# EAGLE schematic Adafruit Feather ESP32-C6-AUSSEN (EAGLE 9.6.2)
COMPANY: ADAFRUIT INDUSTRIES; DRAWN: KTOWN; REV: B
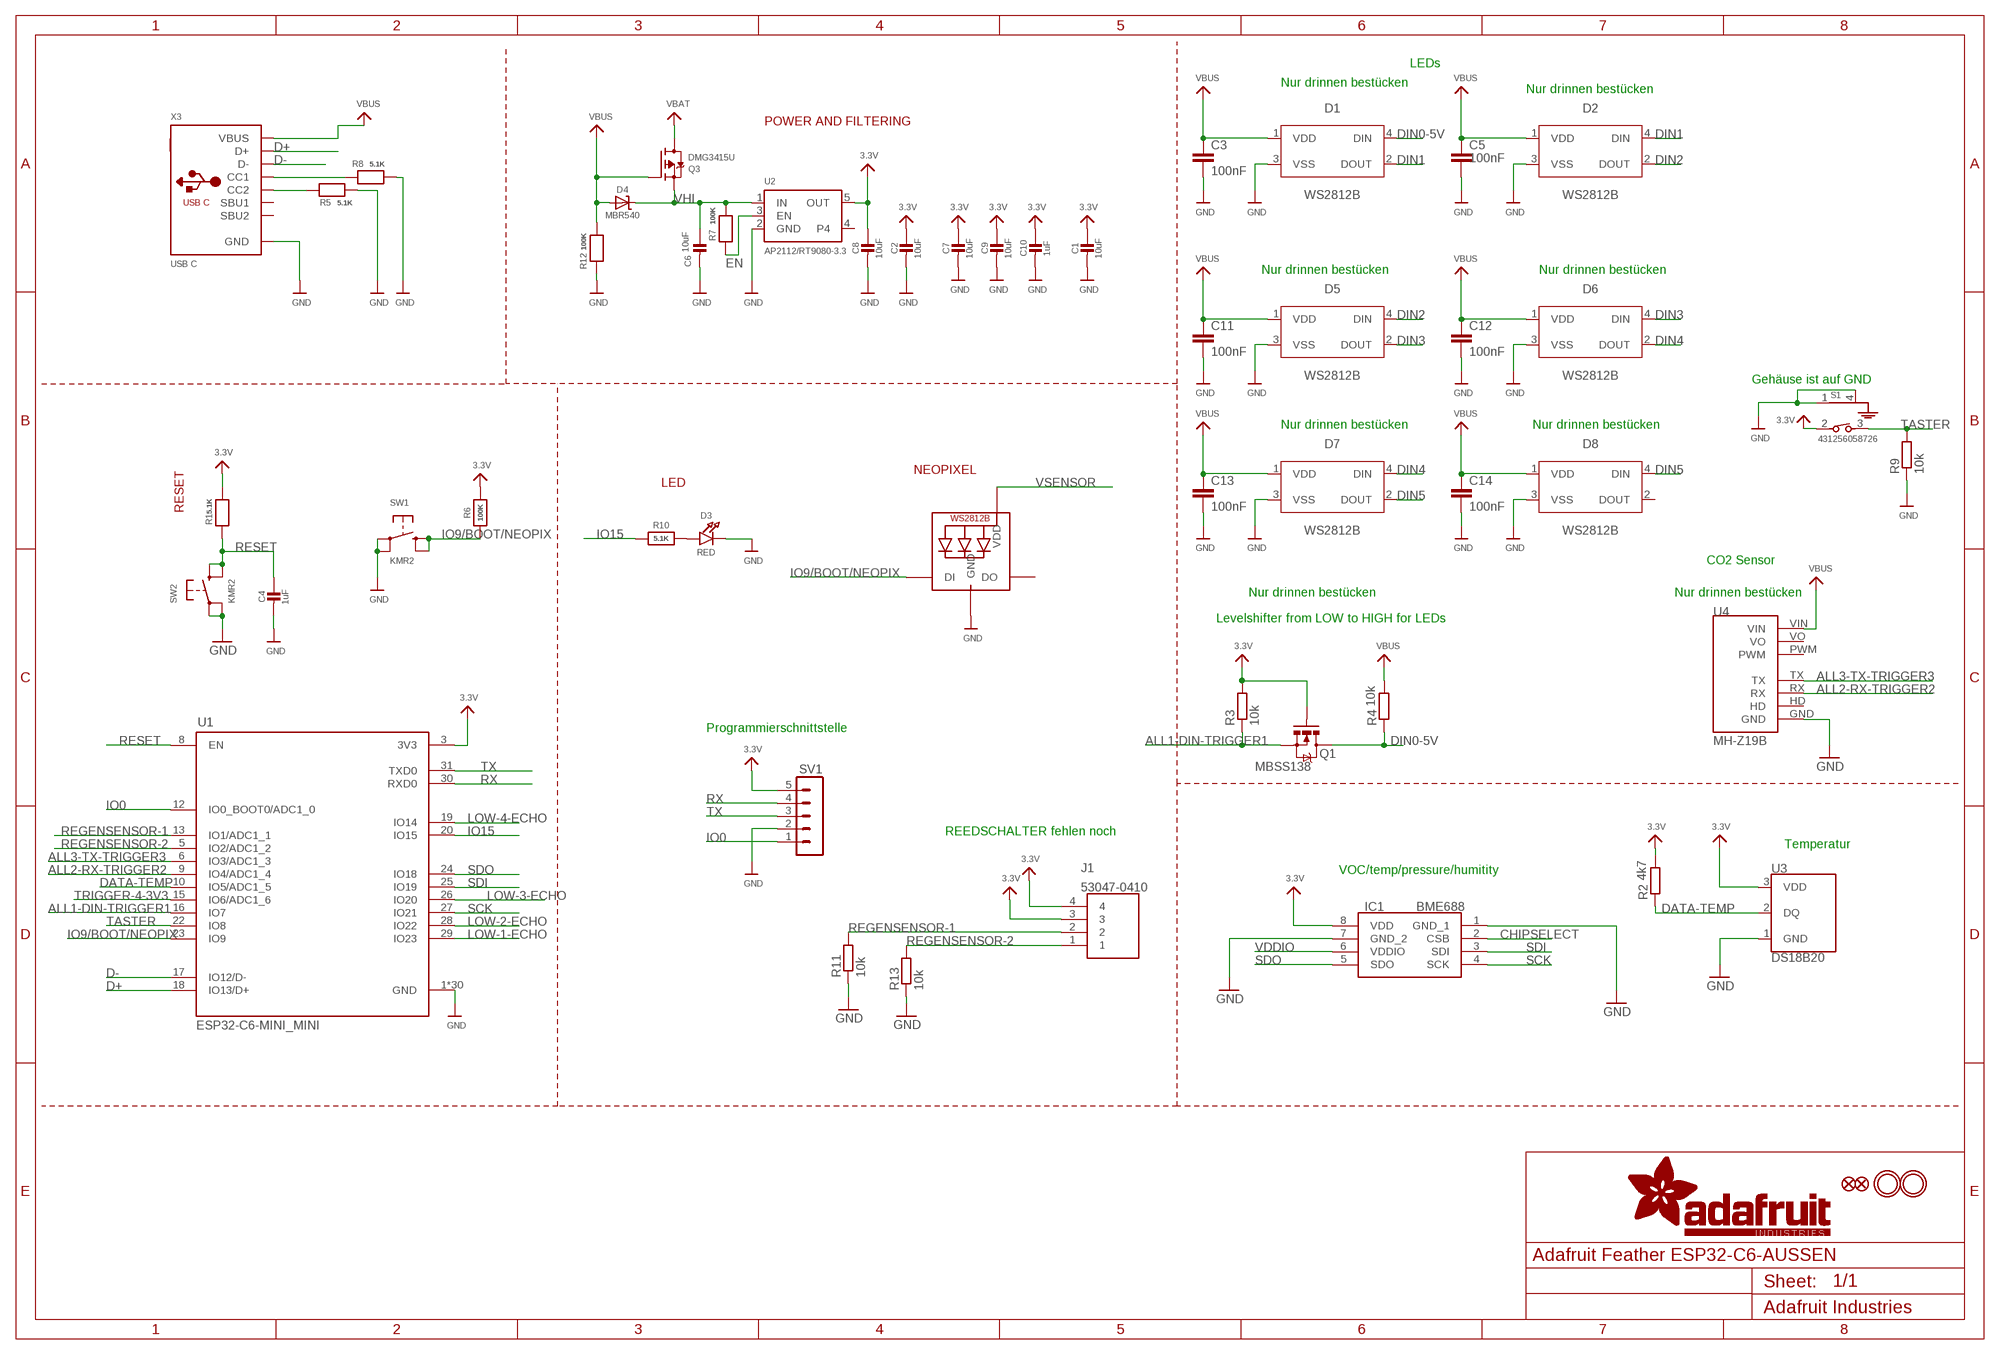
[diagram p0: schematic, sheet 1, part 1 of 2]
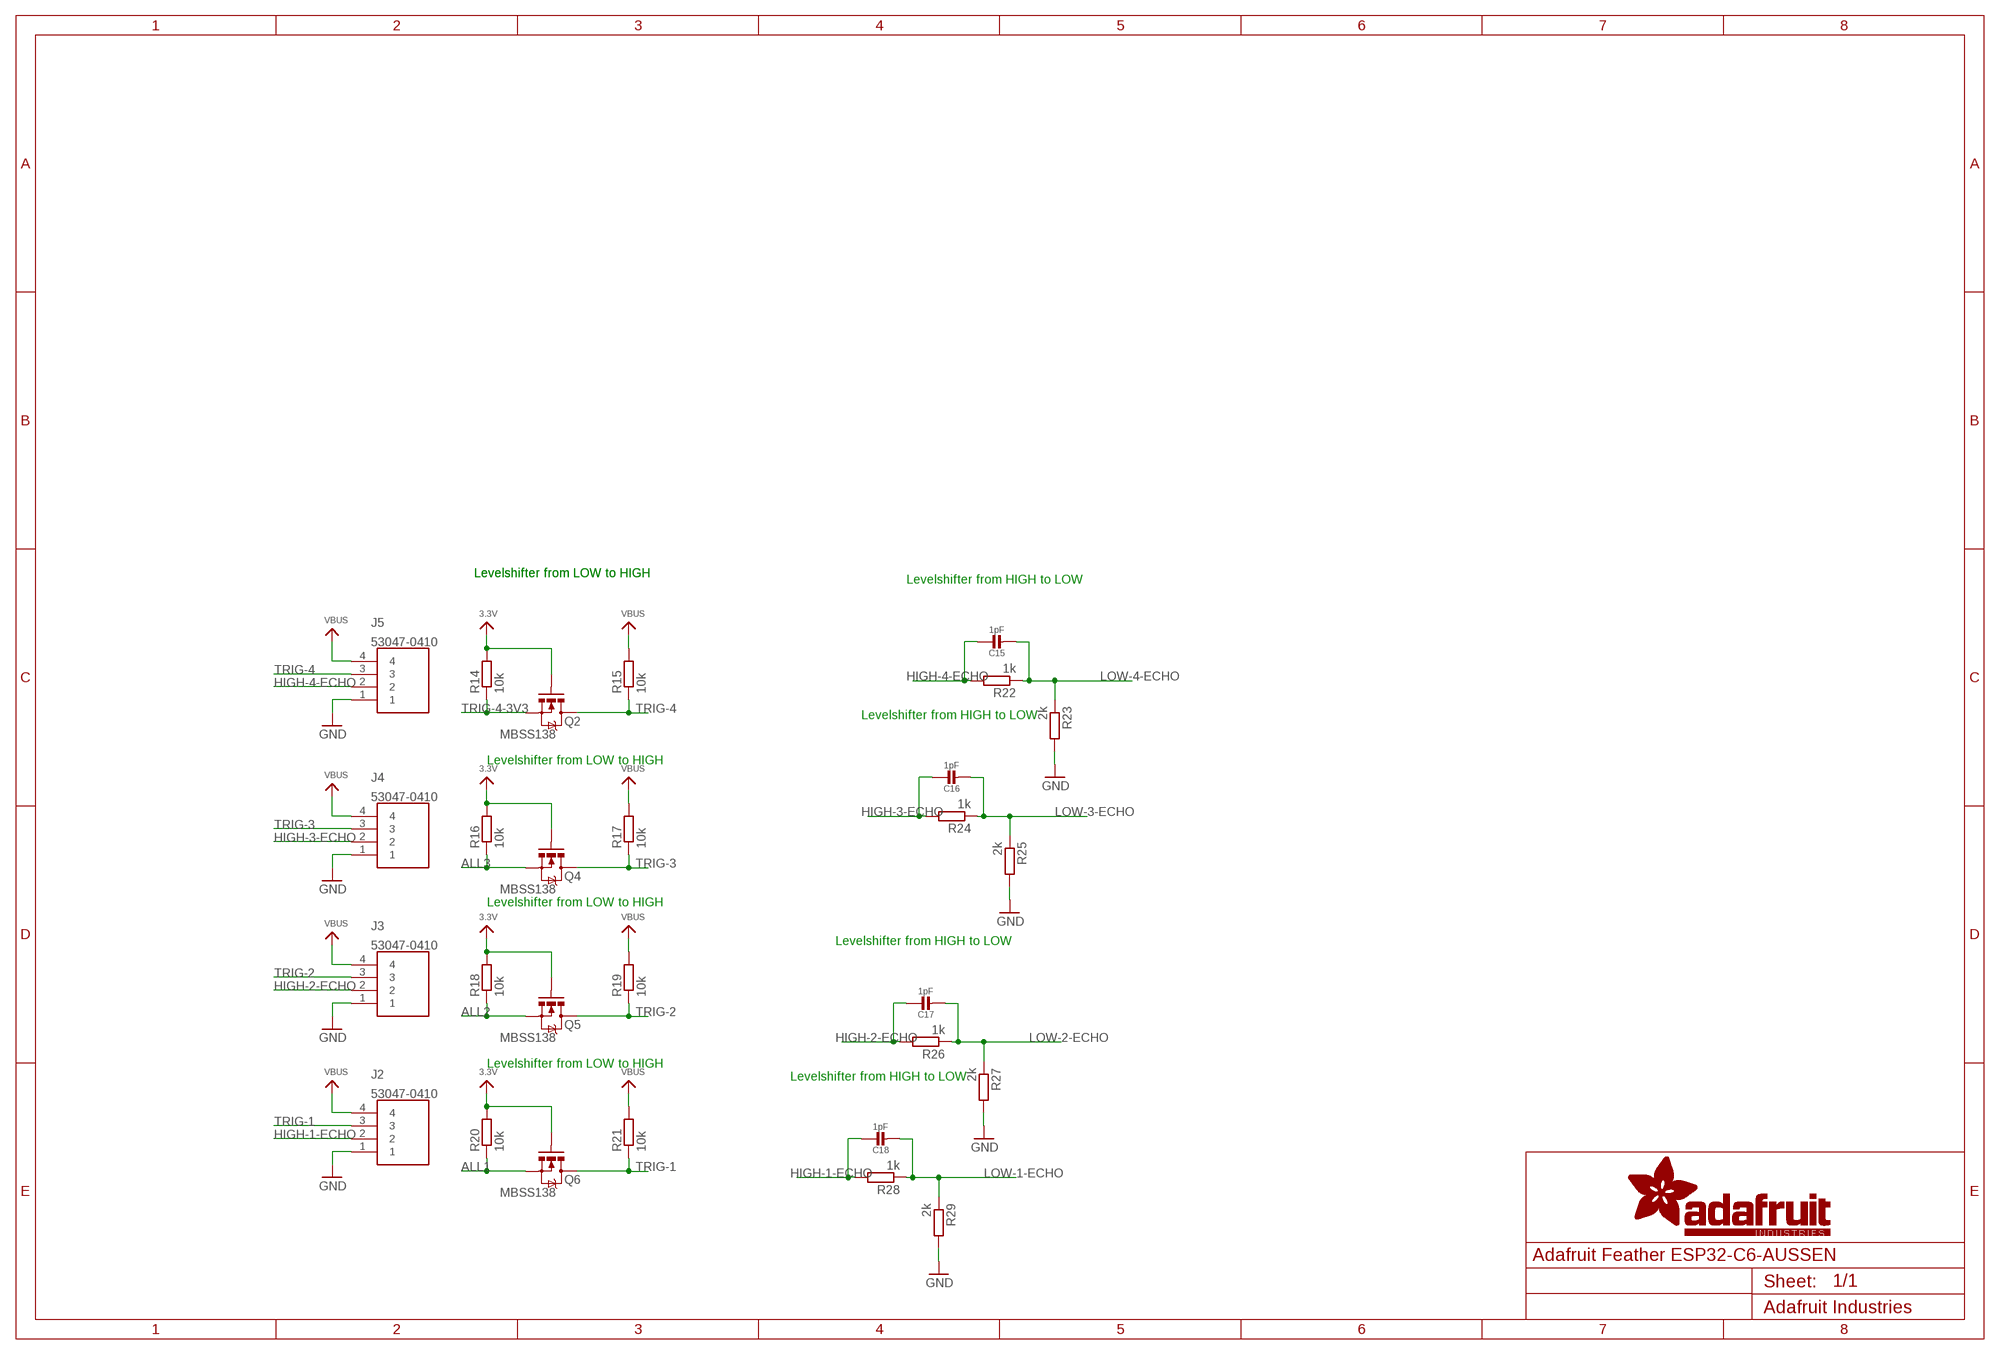
[diagram p1: schematic, sheet 1, part 2 of 2]

## Parts
C1  10uF  CAP_CERAMIC0805-NOOUTLINE  [0805-NO]
C2  10uF  CAP_CERAMIC0805-NOOUTLINE  [0805-NO]
C3  100nF  C-EUC0603  [C0603]
C4  1uF  CAP_CERAMIC0603_NO  [0603-NO]
C5  100nF  C-EUC0603  [C0603]
C6  10uF  CAP_CERAMIC0805-NOOUTLINE  [0805-NO]
C7  10uF  CAP_CERAMIC0805-NOOUTLINE  [0805-NO]
C8  10uF  CAP_CERAMIC0805-NOOUTLINE  [0805-NO]
C9  10uF  CAP_CERAMIC0805-NOOUTLINE  [0805-NO]
C10  1uF  CAP_CERAMIC0603_NO  [0603-NO]
C11  100nF  C-EUC0603  [C0603]
C12  100nF  C-EUC0603  [C0603]
C13  100nF  C-EUC0603  [C0603]
C14  100nF  C-EUC0603  [C0603]
C15  1pF  CAP_CERAMIC0603_NO  [0603-NO]
C16  1pF  CAP_CERAMIC0603_NO  [0603-NO]
C17  1pF  CAP_CERAMIC0603_NO  [0603-NO]
C18  1pF  CAP_CERAMIC0603_NO  [0603-NO]
D1  WS2812B  [WS2812B]
D2  WS2812B  [WS2812B]
D3  RED  LED0603_NOOUTLINE  [CHIPLED_0603_NOOUTLINE]
D4  MBR540  DIODE-SCHOTTKYSOD-123  [SOD-123]
D5  WS2812B  [WS2812B]
D6  WS2812B  [WS2812B]
D7  WS2812B  [WS2812B]
D8  WS2812B  [WS2812B]
IC1  BME688  [BME688]
J1  53047-0410  [530470410]
J2  53047-0410  [530470410]
J3  53047-0410  [530470410]
J4  53047-0410  [530470410]
J5  53047-0410  [530470410]
LED1  WS2812B_3535FULL  [LED3535_FULLPADS]
Q1  MBSS138  MOSFET-NCHANNELBSS138  [SOT23]
Q2  MBSS138  MOSFET-NCHANNELBSS138  [SOT23]
Q3  DMG3415U  MOSFET-P  [SOT23-R]
Q4  MBSS138  MOSFET-NCHANNELBSS138  [SOT23]
Q5  MBSS138  MOSFET-NCHANNELBSS138  [SOT23]
Q6  MBSS138  MOSFET-NCHANNELBSS138  [SOT23]
R1  5.1K  RESISTOR_0603_NOOUT  [0603-NO]
R2  4k7  R-EU_0207/12  [0207/12]
R3  10k  R-EU_0207/12  [0207/12]
R4  10k  R-EU_0207/12  [0207/12]
R5  5.1K  RESISTOR_0603_NOOUT  [0603-NO]
R6  100K  RESISTOR_0603_NOOUT  [0603-NO]
R7  100K  RESISTOR_0603_NOOUT  [0603-NO]
R8  5.1K  RESISTOR_0603_NOOUT  [0603-NO]
R9  10k  R-EU_0207/12  [0207/12]
R10  5.1K  RESISTOR_0603_NOOUT  [0603-NO]
R11  10k  R-EU_0207/12  [0207/12]
R12  100K  RESISTOR_0603_NOOUT  [0603-NO]
R13  10k  R-EU_0207/12  [0207/12]
R14  10k  R-EU_0207/12  [0207/12]
R15  10k  R-EU_0207/12  [0207/12]
R16  10k  R-EU_0207/12  [0207/12]
R17  10k  R-EU_0207/12  [0207/12]
R18  10k  R-EU_0207/12  [0207/12]
R19  10k  R-EU_0207/12  [0207/12]
R20  10k  R-EU_0207/12  [0207/12]
R21  10k  R-EU_0207/12  [0207/12]
R22  1k  R-EU_0207/12  [0207/12]
R23  2k  R-EU_0207/12  [0207/12]
R24  1k  R-EU_0207/12  [0207/12]
R25  2k  R-EU_0207/12  [0207/12]
R26  1k  R-EU_0207/12  [0207/12]
R27  2k  R-EU_0207/12  [0207/12]
R28  1k  R-EU_0207/12  [0207/12]
R29  2k  R-EU_0207/12  [0207/12]
S1  431256058726  [4312560587X6]
SV1  MAR05-1  [MAR05-1]
SW1  KMR2  SWITCH_TACT_SMT_RKB2  [BTN_RKB2_4.6X2.8]
SW2  KMR2  SWITCH_TACT_SMT_RKB2  [BTN_RKB2_4.6X2.8]
U1  ESP32-C6-MINI_MINI  [ESP32-PICO-MINI]
U2  AP2112/RT9080-3.3  VREG_SOT23-5  [SOT23-5]
U3  DS18B20  [TO-92-AMMO]
U4  MH-Z19B  [MH-Z19B]
U$31  MOUNTINGHOLE2.5  [MOUNTINGHOLE_2.5_PLATED]
U$32  MOUNTINGHOLE2.5  [MOUNTINGHOLE_2.5_PLATED]
U$34  FIDUCIAL_1MM  [FIDUCIAL_1MM]
U$35  FIDUCIAL_1MM  [FIDUCIAL_1MM]
X3  USB C  USB_C  [USB_C_CUSB31-CFM2AX-01-X]

## Nets
3.3V: C1.1 C2.1 C7.1 C8.1 C9.1 C10.1 IC1.8(VDD) J1.3 J1.4 Q1.1(G) Q2.1(G) Q4.1(G) Q5.1(G) Q6.1(G) R1.2 R2.2 R3.2 R6.2 R14.2 R16.2 R18.2 R20.2 S1.2 SV1.5 U1.3(3V3) U2.5(OUT) U3.3(VDD)
ALL1: Q6.2(S) R20.1
ALL1-DIN-TRIGGER1: Q1.2(S) R3.1 U1.16(IO7)
ALL2: Q5.2(S) R18.1
ALL2-RX-TRIGGER2: U1.9(IO4/ADC1_4) U4.RX
ALL3: Q4.2(S) R16.1
ALL3-TX-TRIGGER3: U1.6(IO3/ADC1_3) U4.TX
CHIPSELECT: IC1.2(CSB)
D+: U1.18(IO13/D+) X3.A6(D+) X3.B6(D+)
D-: U1.17(IO12/D-) X3.A7(D-) X3.B7(D-)
DATA-TEMP: R2.1 U1.10(IO5/ADC1_5) U3.2(DQ)
DIN0-5V: D1.4(DIN) Q1.3(D) R4.1
DIN1: D1.2(DOUT) D2.4(DIN)
DIN2: D2.2(DOUT) D5.4(DIN)
DIN3: D5.2(DOUT) D6.4(DIN)
DIN4: D6.2(DOUT) D7.4(DIN)
DIN5: D7.2(DOUT) D8.4(DIN)
EN: R7.1 U2.3(EN)
GND: C1.2 C2.2 C3.2 C4.2 C5.2 C6.2 C7.2 C8.2 C9.2 C10.2 C11.2 C12.2 C13.2 C14.2 D1.3(VSS) D2.3(VSS) D3.C D5.3(VSS) D6.3(VSS) D7.3(VSS) D8.3(VSS) IC1.1(GND_1) IC1.7(GND_2) J2.1 J3.1 J4.1 J5.1 LED1.4(GND) R5.1 R8.1 R9.1 R11.1 R12.1 R13.1 R23.2 R25.2 R27.2 R29.2 S1.1(GND1) S1.4(GND) SV1.2 SW1.A'(P1) SW1.A(P) SW2.A'(P1) SW2.A(P) U1.1(GND) U1.2(GND) U1.11(GND) U1.14(GND) U1.36(GND) U1.37(GND) U1.38(GND) U1.39(GND) U1.40(GND) U1.41(GND) U1.42(GND) U1.43(GND) U1.44(GND) U1.45(GND) U1.46(GND) U1.47(GND) U1.48(GND) U1.49(GND) U1.50(GND) U1.51(GND) U1.52(GND) U1.53(GND) U1.54(GND) U1.55(GND) U1.56(GND) U1.57(GND) U1.58(GND) U1.59(GND) U1.60(GND) U1.61(GND) U2.2(GND) U3.1(GND) U4.GND X3.A1B12(GND) X3.B1A12(GND)
HIGH-1-ECHO [Power]: C18.1 J2.2 R28.2
HIGH-2-ECHO [Power]: C17.1 J3.2 R26.2
HIGH-3-ECHO [Power]: C16.1 J4.2 R24.2
HIGH-4-ECHO [Power]: C15.1 J5.2 R22.2
IO0: SV1.1 U1.12(IO0_BOOT0/ADC1_0)
IO9/BOOT/NEOPIX: LED1.1(DI) R6.1 SW1.B'(S1) SW1.B(S) U1.23(IO9)
IO15: R10.1 U1.20(IO15)
LOW-1-ECHO: C18.2 R28.1 R29.1 U1.29(IO23)
LOW-2-ECHO: C17.2 R26.1 R27.1 U1.28(IO22)
LOW-3-ECHO: C16.2 R24.1 R25.1 U1.26(IO20)
LOW-4-ECHO: C15.2 R22.1 R23.1 U1.19(IO14)
N$5: D3.A R10.2
N$8: R8.2 X3.A5(CC1)
N$9: R5.2 X3.B5(CC2)
REGENSENSOR-1: J1.2 R11.2 U1.13(IO1/ADC1_1)
REGENSENSOR-2: J1.1 R13.2 U1.5(IO2/ADC1_2)
RESET: C4.1 R1.1 SW2.B'(S1) SW2.B(S) U1.8(EN)
RX: SV1.4 U1.30(RXD0)
SCK: IC1.4(SCK) U1.27(IO21)
SDI: IC1.3(SDI) U1.25(IO19)
SDO: IC1.5(SDO) U1.24(IO18)
TASTER: R9.2 S1.3 U1.22(IO8)
TRIG-1: J2.3 Q6.3(D) R21.1
TRIG-2: J3.3 Q5.3(D) R19.1
TRIG-3: J4.3 Q4.3(D) R17.1
TRIG-4: J5.3 Q2.3(D) R15.1
TRIG-4-3V3: Q2.2(S) R14.1
TRIGGER-4-3V3: U1.15(IO6/ADC1_6)
TX: SV1.3 U1.31(TXD0)
VBAT [Power]: Q3.3(D)
VBUS [Power]: C3.1 C5.1 C11.1 C12.1 C13.1 C14.1 D1.1(VDD) D2.1(VDD) D4.A D5.1(VDD) D6.1(VDD) D7.1(VDD) D8.1(VDD) J2.4 J3.4 J4.4 J5.4 Q3.1(G) R4.2 R12.2 R15.2 R17.2 R19.2 R21.2 U4.VIN X3.A4B9(VBUS) X3.B4A9(VBUS)
VDDIO: IC1.6(VDDIO)
VHI [Power]: C6.1 D4.C Q3.2(S) R7.2 U2.1(IN)
VSENSOR [Power]: LED1.2(VDD)
Unconnected: D8.2(DOUT) LED1.3(DO) U2.4 U4.HD U4.PWM U4.VO X3.A8(SBU1) X3.B8(SBU2)

## Notes on the sheet
- LEDs
- Nur drinnen bestücken
- Nur drinnen bestücken
- POWER AND FILTERING
- Nur drinnen bestücken | Nur drinnen bestücken
- Gehäuse ist auf GND
- Nur drinnen bestücken | Nur drinnen bestücken
- NEOPIXEL
- LED
- RESET
- CO2 Sensor
- Levelshifter from LOW to HIGH | Levelshifter from LOW to HIGH
- Levelshifter from HIGH to LOW
- Nur drinnen bestücken | Nur drinnen bestücken
- Levelshifter from LOW to HIGH for LEDs
- Levelshifter from HIGH to LOW
- Programmierschnittstelle
- Levelshifter from LOW to HIGH
- REEDSCHALTER fehlen noch
- Temperatur
- VOC/temp/pressure/humitity
- Levelshifter from LOW to HIGH
- Levelshifter from HIGH to LOW
- Levelshifter from LOW to HIGH
- Levelshifter from HIGH to LOW

## Library data of the parts
C1 C2 C4 C6 C7 C9 C10 C15-C18 = microbuilder:CAP_CERAMIC: Ceramic Capacitors For new designs, use the packages preceded by an '_' character since they are more reliable: The following footprints should be used on most boards: _0402 - Standard footprint for regular board layouts _0603 - Standard footprint for regular board layouts _0805 - Standard footprint for regular board layouts _1206 - Standard footprint for regular board layouts For extremely tight-pitch boards where space is at a premium, the following 'micro-pitch' footprints can be used (smaller pads, no silkscreen outline, etc.): _0402MP - Micro-pitch footprint for very dense/compact boards _0603MP - Micro-pitch footprint for very dense/compact boards _0805MP - Micro-pitch footprint for very dense/compact boards _1206MP - Micro-pitch footprint for very dense/compact boards
C3 C5 C11-C14 = rcl:C-EU: CAPACITOR, European symbol; SPICEPREFIX: C
C8 = microbuilder:CAP_CERAMIC: Ceramic Capacitors For new designs, use the packages preceded by an '_' character since they are more reliable: The following footprints should be used on most boards: _0402 - Standard footprint for regular board layouts _0603 - Standard footprint for regular board layouts _0805 - Standard footprint for regular board layouts _1206 - Standard footprint for regular board layouts For extremely tight-pitch boards where space is at a premium, the following 'micro-pitch' footprints can be used (smaller pads, no silkscreen outline, etc.): _0402MP - Micro-pitch footprint for very dense/compact boards _0603MP - Micro-pitch footprint for very dense/compact boards _0805MP - Micro-pitch footprint for very dense/compact boards _1206MP - Micro-pitch footprint for very dense/compact boards; REV: B
D1 D2 D5-D8 = LED:WS2812B: Intelligent control LED integrated light source Datasheet <https://cdn-shop.adafruit.com/datasheets/WS2812B.pdf>; CATEGORY: LED; COLOR: RGB; DATASHEET: https://cdn-shop.adafruit.com/datasheets/WS2812B.pdf; DESCRIPTION: LED integrated light source; MANUFACTURER: Worldsemi; MPN: WS2812B; OPERATING_TEMPERATURE: -55°C ~ 150°C; PACKAGE_SIZE: 5050; PACKAGE_TYPE: SMD; PART_STATUS: ACTIVE; ROHS: COMPLIANT; SERIES: WS2812B; SUBCATEGORY: Chip LED Addressable; TYPE: Square with Flat Top
D3 = microbuilder:LED: LED 0603 - 0603 Surface Mount Package 2mA: Green LED - Low Power (3.9mcd, 2ma, 1.7Vf) - Digikey: 475-2709-2-ND Orange LED - Low Power (9.8mcd, 2ma, 1.8Vf) - Digikey: 475-1194-2-ND Red LED - Low Power (5mcd, 2ma, 1.8Vf) - Digikey: 475-1195-2-ND Yellow LED - Low Power (7mcd, 2ma, 1.8Vf) - Digikey: 475-1196-2-ND 5mA: Blue LED - Low Power (17mcd, 5ma, 2.9Vf) - Digikey: LNJ937W8CRACT-ND 0805 - 0805 Surface Mount Package 2mA: Red LED (8.8mcd, 2mA, 1.8Vf, Clear) - Low Power [Digikey: 475-2510-1-ND] Green LED (5mcd, 2mA, 1.8Vf, Clear) - Low Power [Digikey: 475-2730-1-ND] Yellow LED (11.3mcd, 2mA, 1.8Vf, Clear) - Low Power [Digikey: 475-2555-1-ND] 20mA: Red LED (104mcd, 20mA, Diffused) - LS R976 [Digikey: 475-1278-6-ND] Red LED (12mcd, 20mA, 2.0Vf, Clear) - APT2012EC [Digikey: 754-1128-1-ND] Green LED (15mcd, 20mA, 2.2Vf, Clear) - APT2012GC [Digikey: 754-1131-1-ND] Orange LED (160mcd, 20mA, 2.1Vf, Clear) - APT2012SECK [Digikey: 754-1130-1-ND] 1206 - 1206 Surface Mount Package Green LED (26mcd, 20mA, Diffused) - LG N971 [Digikey: 475-1407-6-ND] Red LED (15mcd, 20mA, Diffused) - LH N974 [Digikey: 475-1416-6-ND] Cree - Cree High-Power Surface Mount LEDs XPEBWT-L1-0000-00D50 - White 111lm 350mA 2.9Vf 6200K 110° XTEAWT-00-0000-00000LEE3 - White 114lm 350mA 2.85Vf 5000K 115° Everlight - Everlight 45-21 Series Surface Mount LEDs 45-21/QK2C-B2832AC2CB2/2T - Warm White 2000mcd 20mA 3.25Vf 3050K 120° 45-21/LK2C-B38452C4CB2/2T - Nuetral White 2000mcd 20mA 3.25Vf 4150K 120° 45-21/LK2C-B50634C6CB2/2T - Cold White 2200mcd 20mA 3.25Vf 5650K 120° PLCC2 Reverse Mount LS T77K-J1L2-1-0-2-R18-Z - Red 11.25mcd 2mA 1.8Vf 630nm 120° LO T77K-L1M2-24-Z - Orange 19.6mcd 2mA 1.8Vf 606nm 120° LY T77K-K2M1-26-Z - Yellow 15.7mcd 2mA 1.8Vf 587nm 120°; ROT: 270
D4 = microbuilder:DIODE-SCHOTTKY
IC1 = BME688:BME688: Gas sensor measuring relative humidity, barometric pressure, ambient temperature and gas (VOC) Source: Datasheet <https://www.bosch-sensortec.com/media/boschsensortec/downloads/datasheets/bst-bme688-ds000.pdf>; DESCRIPTION: Gas sensor measuring relative humidity, barometric pressure, ambient temperature and gas (VOC); HEIGHT: 1mm; MANUFACTURER_NAME: BOSCH; MANUFACTURER_PART_NUMBER: BME688; MOUSER_PART_NUMBER: 262-BME688; MOUSER_PRICE-STOCK: https://www.mouser.co.uk/ProductDetail/Bosch-Sensortec/BME688?qs=IS%252B4QmGtzzqQoVDscqwx3A%3D%3D
J1-J5 = 53047-0410:53047-0410: Headers & Wire Housings VERTICAL HDR 4P Source: Datasheet <https://www.molex.com/pdm_docs/sd/530470410_sd.pdf>; DESCRIPTION: Headers & Wire Housings VERTICAL HDR 4P; HEIGHT: 4.4mm; MANUFACTURER_NAME: Molex; MANUFACTURER_PART_NUMBER: 53047-0410; MOUSER_PART_NUMBER: 538-53047-0410; MOUSER_PRICE-STOCK: https://www.mouser.co.uk/ProductDetail/Molex/53047-0410?qs=DcEdecHHM4i8IPBxVAuJtg%3D%3D
LED1 = microbuilder:WS2812B
Q1 Q2 Q4-Q6 = BeagleBone_Blue_R3:MOSFET-NCHANNEL: Common NMOSFET Parts MFG P/N Store ID Prod ID FDD8780 TRANS-09984 SI7820DN TRANS-11055 FDS6630A IC-08089 2N7002PW TRANS-11151 FQP30N06L COM-10213 TRANS-10060 BSS123LT1G TRANS-08345 BSS138 TRANS-00830 BS170 2N7000; PROD_ID: TRANS-00830
Q3 = microbuilder:MOSFET-P: P-Channel Mosfet LEGEND VDS: Voltage Drain-Source ID: Drain Current RDS(ON): Drain-Source On-State Resistance VGS(TH): Gate-Source Threshold Voltage CISS: Drain-Source Input Capacitance SOT-23 Name VDS ID RDS(ON) VGS(TH) CISS Order Number IRLML5103 30V 760mA 600 mOhm -- 75pF @ 25V Digikey: IRLML5103PBFCT-ND IRLML6401 12V 4.3A 50 mOhm 950mV @ 250µA 830pF @ 10V Digikey: IRLML6401PBFTR-ND NTR0202PL 20V 400mA 800 mOhm 2.3V @ 250uA 70pF @ 5V Digikey: NTR0202PLT1GOSTR-ND NTR4101PT1G 20V 1.8A 85 mOhm 1.2V @ 250uA 675pF @ 10V Digikey: NTR4101PT1GOSCT-ND DMP2004K 20V 600mA 900 mOhm 1V @ 250uA 175pF @ 16V Digikey: DMP2004KDICT-ND PMV65XP 20V 3.9A 76 mOhm 950mV @ 1mA 725pF @ 20V Digikey: 568-2358-2-ND TO-252 Name VDS ID RDS(ON) VGS(TH) CISS Order Number AOD417 30V 25A 34 mOhm 3V @ 250µA 920pF @ 15V Digikey: 785-1106-2-ND PowerPak Name VDS ID RDS(ON) VGS(TH) CISS Order Number AON7401 30V 12A 14 mOhm 3V @ 250µA 2600pF @ 15V Digikey: 785-1302-1-ND
R1 R5-R8 R10 R12 = microbuilder:RESISTOR: Resistors For new designs, use the packages preceded by an '_' character since they are more reliable: The following footprints should be used on most boards: _0402 - Standard footprint for regular board layouts _0603 - Standard footprint for regular board layouts _0805 - Standard footprint for regular board layouts _1206 - Standard footprint for regular board layouts For extremely tight-pitch boards where space is at a premium, the following 'micro-pitch' footprints can be used (smaller pads, no silkscreen outline, etc.): _0402MP - Micro-pitch footprint for very dense/compact boards _0603MP - Micro-pitch footprint for very dense/compact boards _0805MP - Micro-pitch footprint for very dense/compact boards _1206MP - Micro-pitch footprint for very dense/compact boards
R2-R4 R9 R11 R13-R29 = rcl:R-EU_: RESISTOR, European symbol
S1 = 431256058726:431256058726: Check availability <https://pricing.snapeda.com/parts/431256058716/W%C3%BCrth%20Elektronik/view-part?ref=eda>; AVAILABILITY: In Stock; CHECK_PRICES: https://www.snapeda.com/parts/431256058716/W%25C3%25BCrth+Elektronik+Midcom/view-part/?ref=eda; DESCRIPTION: Tactile Switch SPST-NO Side Actuated Through Hole, Right Angle; MF: Würth Elektronik; MP: 431256058716; PACKAGE: None; PRICE: None; SNAPEDA_LINK: https://www.snapeda.com/parts/431256058716/W%25C3%25BCrth+Elektronik+Midcom/view-part/?ref=snap
SV1 = con-lstb:MAR05-1: PIN HEADER; OC_FARNELL: unknown; OC_NEWARK: unknown
SW1 SW2 = adafruit_electromech:SWITCH_TACT_SMT: SMT Tact Switches RKB2 https://www.digikey.com/short/m027prz5
U1 = adafruit_wireless:ESP32-C6-MINI
U2 = adafruit_power:VREG_SOT23-5: SOT23-5 Fixed Voltage Regulators Part Current Out V Out V In V Dropout θJA (°C/W) TJ (°C) Digikey Part No. ADP121 150mA 3.3V 3.4-5.5V 0.09V @ 150mA -- -- ADP121-AUJZ33R7CT-ND ADP121 150mA 3.0V 3.1-5.5V 0.09V @ 150mA -- -- ADP121-AUJZ30R7CT-ND ADP122 300mA 3.3V 3.4-5.5V 0.085V @ 300mA -- -- ADP122AUJZ-3.3-R7CT-ND ADP1712 300mA 3.3V 3.5-5.5V 0.17V @ 300mA -- -- ADP1712AUJZ-3.3-R7TR-ND AP7311 (Low Cost) 150mA 3.3V 3.5-6V 0.15V @ 150mA -- -- AP7311-33WG-7DICT-ND LD39015M18R 150mA 1.8V 1.9V-5.5V 0.08V @ 100mA -- -- 497-6977-1-ND LP2985A-33DBVR 150mA 3.3V 3.3-16V 0.28V @ 150mA 206 150 296-18479-1-ND MCP1824T-3302E/OT 300mA 3.3V 3.5V-6V 0.2V @ 300mA -- -- MCP1824T-3302E/OTCT-ND MIC5205-2.5YM5 TR 150mA 2.5V 2.7-16V 0.165V @ 150mA -- -- 576-1257-2-ND MIC5205-3.0YM5 TR 150mA 3.0V 3.2V-16V 0.165V @ 150mA -- -- 576-1258-2-ND MIC5205-3.3YM5 TR 150mA 3.3V 3.5V-16V 0.165V @ 150mA -- -- 576-1259-2-ND TPS780330220 150mA 3.3V+2.2V 3.6-5.5V 250mV Max -- -- 296-23332-1-ND TDA3663/N1,135 100mA 3.3V 3.5-45V 0.18V @ 50mA -- -- 568-5343-1-ND Max operating temp can be calculated using θJA, TJ (max junction temperature), and power in watts. Set the "Maximum Ambient Temperature" until it reaches TJ ("Max Junction Temperature"), which is the absolute limit for safe use of the regulator: Heat Sink Temperature Calculator <http://www.daycounter.com/Calculators/Heat-Sink-Temperature-Calculator.phtml> For example, With 12V source into a 3.3V LP2985 and a 30mA load, we are dissipating (12V-3.3V) * 0.03A = 0.261W. With a θJA of 206 °C/W, a TJ of 150°C, and 261mW we can safely use the chip without a heat sink up to 75°C (=147.1°C Junction Temperature).; JLC_ROTATION: 0
U3 = SparkFun-Sensors:DS18B20: Dallas/Maxim DS18B20 1-Wire Temperature Sensor The DS18B20 reports degrees C with 9 to 12-bit precision, -55C to 125C (+/-0.5C). Each sensor has a unique 64-Bit Serial number etched into it - allows for a huge number of sensors to be used on one data bus. Datasheet <http://datasheets.maximintegrated.com/en/ds/DS18B20.pdf> SparkFun Products One Wire Digital Temperature Sensor - DS18B20 <https://www.sparkfun.com/products/245> (SEN-00245); STORE_ID: SEN-00245
U4 = MH-Z19B:MH-Z19B: Check availability <https://pricing.snapeda.com/parts/MH-Z19B/Winsen/view-part?ref=eda>; AVAILABILITY: Not in stock; CHECK_PRICES: https://www.snapeda.com/parts/MH-Z19B/Winsen/view-part/?ref=eda; DESCRIPTION: Intelligent Infrared CO2 Module; MF: Winsen; MP: MH-Z19B; PACKAGE: Package; PRICE: None; SNAPEDA_LINK: https://www.snapeda.com/parts/MH-Z19B/Winsen/view-part/?ref=snap
U$31 U$32 = adafruit_electromech:MOUNTINGHOLE: Mounting Hole For #2 screws (0.086"/2.18mm width, 0.094"/2.4mm hole) use 2.5mm; BOM: EXCLUDE
U$34 U$35 = microbuilder:FIDUCIAL: Fiducial Alignment Points Various fiducial points for machine vision alignment.; BOM: EXCLUDE
X3 = adafruit_electromech:USB_C: USB Type-C USB 2.0 Connector; LCSC: C165948

## Net classes
2 gnd: width 0.254 mm, drill 0.483 mm
3 Power: width 0.305 mm, drill 0.483 mm